# Altium schematic sheet Power.SchDoc: Power
size A; DrawnBy: Sindre Hovland; Organization: Advanced Wearables Nordic Semi; Revision: V1; SheetNumber: 3; SheetTotal: 4
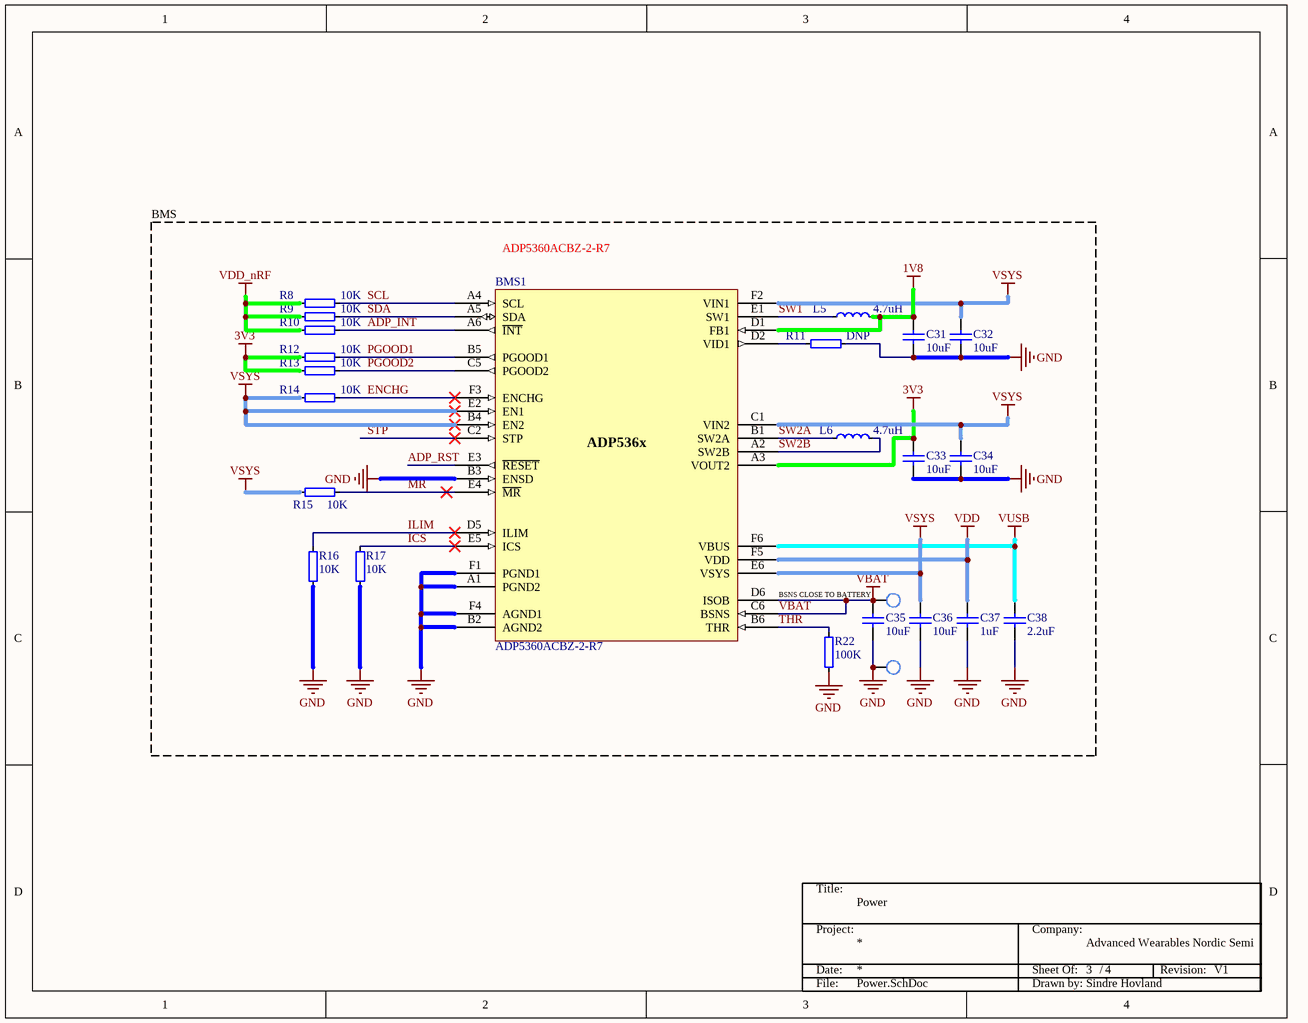
[diagram p0: Power.SchDoc]

## Parts
*  TitleBlock  (value not drawn)  (graphical)
BMS1  ADP5360ACBZ-2-R7  [BGA32C40P6X6_238X238X56]
C31  10uF  [C0603]
C32  10uF  [C0603]
C33  10uF  [C0603]
C34  10uF  [C0603]
C35  10uF  [C0603]
C36  10uF  [C0603]
C37  1uF  [C0402]
C38  2.2uF  [C0402]
GND  DNP  [TP_SMD_1.0mm]  (value not drawn)
L5  4.7uH  [IND2016]
L6  4.7uH  [IND2016]
R8  10K  [RES0402]
R9  10K  [RES0402]
R10  10K  [RES0402]
R11  DNP  [RES0402]
R12  10K  [RES0402]
R13  10K  [RES0402]
R14  10K  [RES0402]
R15  10K  [RES0402]
R16  10K  [RES0402]
R17  10K  [RES0402]
R22  100K  [RES0402]
VBAT  DNP  [TP_SMD_1.0mm]  (value not drawn)

## Nets
1V8: BMS1.D1(FB1) C31.2 L5.2
3V3: BMS1.A3(VOUT2) C33.2 R12.1 R13.1
GND: BMS1.A1(PGND2) BMS1.B2(AGND2) BMS1.B3(ENSD) BMS1.F1(PGND1) BMS1.F4(AGND1) C31.1 C32.1 C33.1 C34.1 C35.1 C36.1 C37.1 C38.1 GND.1 R11.2 R16.2 R17.2 R22.2
VBAT: BMS1.C6(BSNS) BMS1.D6(ISOB) C35.2 VBAT.1
VDD: BMS1.F5(VDD) C37.2
VDD_nRF: R8.1 R9.1 R10.1
VSYS: BMS1.B4(EN2) BMS1.C1(VIN2) BMS1.E2(EN1) BMS1.E6(VSYS) BMS1.F2(VIN1) C32.2 C34.2 C36.2 R14.1 R15.1
VUSB: BMS1.F6(VBUS) C38.2
ADP_INT: BMS1.A6(~{INT}) R10.2
ADP_RST: BMS1.E3(~{RESET})
ENCHG: BMS1.F3(ENCHG) R14.2
ICS: BMS1.E5(ICS) R17.1
ILIM: BMS1.D5(ILIM) R16.1
~{MR}: BMS1.E4(~{MR}) R15.2
PGOOD1: BMS1.B5(PGOOD1) R12.2
PGOOD2: BMS1.C5(PGOOD2) R13.2
SCL: BMS1.A4(SCL) R8.2
SDA: BMS1.A5(SDA) R9.2
STP: BMS1.C2(STP)
SW1: BMS1.E1(SW1) L5.1
SW2A: BMS1.B1(SW2A) L6.1
SW2B: BMS1.A2(SW2B) L6.2
THR: BMS1.B6(THR) R22.1
NetBMS1_D2: BMS1.D2(VID1) R11.1

## Notes on the sheet
- BMS
- (near BMS1) ADP5360ACBZ-2-R7
- BSNS CLOSE TO BATTERY
- (in symbol TitleBlock) Title:; Project:; Company:; Date:; Sheet Of:; /; Revision:; File:; Drawn by:

## Library data of the parts
BMS1 = ADP536x: Advanced Battery Management PMIC With Ultralow Iq Buck and Buck-Boost. Order: ADP5360ACBZ-2-R7; Manufacturer: Analog Devices; Part number IPS: 80000001823; Artikkelnr Noca: N.A.; Part Number: ADP536x; Manufacturer Part Number: ADP536x; ComponentLink1URL: *; ComponentLink1Description: Datasheet; ComponentLink2URL: *; ComponentLink2Description: Supplier link; HelpURL: *; Footprint Doc: WLCSP-32; LatestRevisionDate: 2019-03-25; Pin Count: 32; Publisher: Nordic Semiconductor; Published: 2019-03-25; Value: ADP536x; Note: *; Supplier 1: *; Supplier Part Number 1: *; Supplier 2: *; Supplier Part Number 2: *
C31-C38 = CAP: Capacitor; Value: 100pF; Published: 8-Jun-2000; Revision: July-2002: Re-released for DXP Platform.; Publisher: Altium Limited
GND VBAT = TP
L5 L6 = IND: Inductor; Part Number: FB0402-120R@100M-500mA; Manufacturer: Murata; Manufacturer Part Number: BLM15AG121SN1D; Part number IPS: N.A.; Value: 120R/0.55A; Note: Chip EMIFIL Inductor Type Chip Ferrite Bead; Artikkelnr Noca: 33029317; Footprint Doc: 0402; LatestRevisionDate: 2014-01-10; Pin Count: 2; Publisher: Nordic Semiconductor; Published: 2011-11-14; ComponentLink1URL: *; ComponentLink1Description: Datasheet; ComponentLink2URL: *; ComponentLink2Description: Supplier link; HelpURL: http://search.murata.co.jp/Ceramy/image/img/PDF/ENG/L0110S0100BLM15A_SN.pdf
R8-R17 R22 = RES: Resistor, ±5%, 0.05W; Part Number: R0201-0R; Part number IPS: 00000003245; Value: 0R; Note: Chip Res 5%; Artikkelnr Noca: N.A.; Manufacturer: *; Manufacturer Part Number: *; ComponentLink1URL: *; ComponentLink1Description: Datasheet; ComponentLink2URL: *; ComponentLink2Description: Supplier link; HelpURL: *; Footprint Doc: 0201; LatestRevisionDate: 2017-11-09; Pin Count: 2; Publisher: Nordic Semiconductor; Published: 2014-11-13; Supplier 1: *; Supplier Part Number 1: *; Supplier 2: *; Supplier Part Number 2: *